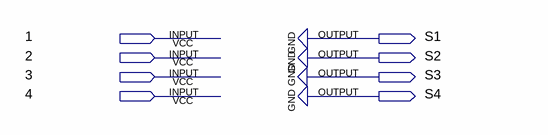
[diagram p0: schematic sheet]
// Quartus schematic shift-left4.bdf as structural Verilog: 0 symbols, 8 pins
module \shift-left4  (
  input  \1 ,
  input  \2 ,
  input  \3 ,
  input  \4 ,
  output S1,
  output S2,
  output S3,
  output S4
);


  assign S1 = 1'b0;
  assign S2 = 1'b0;
  assign S3 = 1'b0;
  assign S4 = 1'b0;
endmodule
